# Altium schematic sheet Thermometers.SchDoc: AMC FMC Carrier v4
size A4; CompanyName: WUT; Organization: WUT ISE; Address1: Warsaw University of Technology; Address2: Nowowiejska 15/19 00-665 Warsaw; Address3: t.przywozki@gmail.com; Revision: 1; SheetNumber: 19; SheetTotal: 29; Project: AMC FMC Carrier v4.0.2; ModifiedBy: F. Świtakowski; CreateDate: XX/XX/XXXX; CheckedDate: -; Title2: Thermometers; DivGrp: ISE; Designer: T. Przywozki; ModifiedDate: -; ProjectName: ADC/DAC MEZZANINE
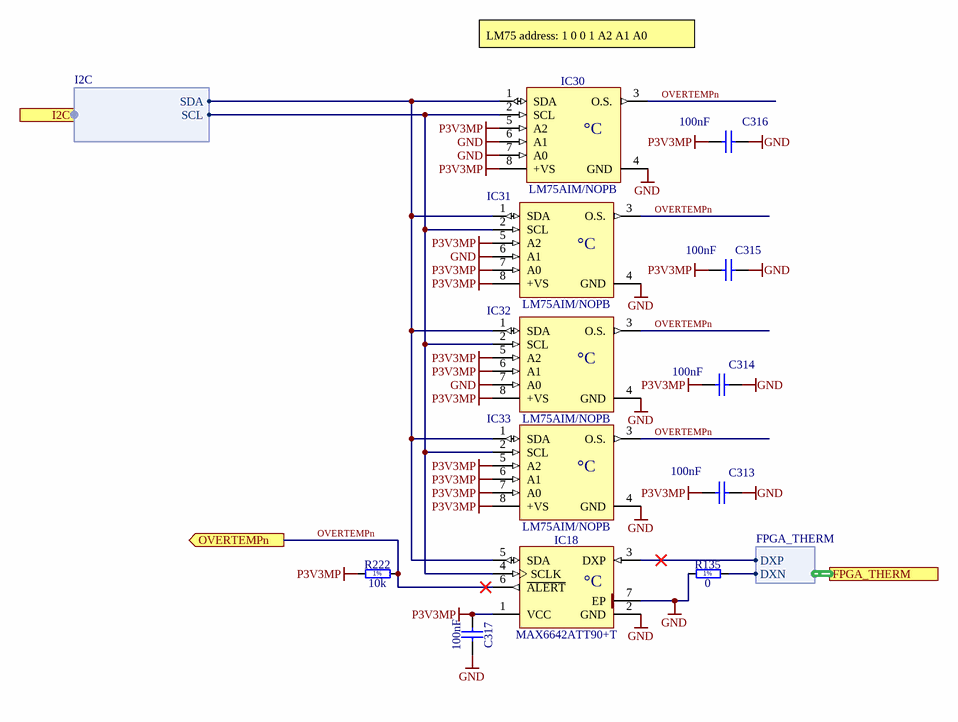
[diagram p0: Thermometers.SchDoc]

## Parts
C313  100nF  [CAPC0603X33N]
C314  100nF  [CAPC0603X33N]
C315  100nF  [CAPC0603X33N]
C316  100nF  [CAPC0603X33N]
C317  100nF  [CAPC0603X33N]
IC18  MAX6642ATT90+T  [SON95P300X300X80-7N-R160X240]
IC30  LM75AIM/NOPB  [SOIC127P600X175-8N]
IC31  LM75AIM/NOPB  [SOIC127P600X175-8N]
IC32  LM75AIM/NOPB  [SOIC127P600X175-8N]
IC33  LM75AIM/NOPB  [SOIC127P600X175-8N]
R135  0  [RESC1005X40N]
R222  10k  [RESC1005X40N]

## Ports
FPGA_THERM (harness FPGA_THERM), I2C (harness I2C), OVERTEMPn (out)

## Harnesses
FPGA_THERM: DXN, DXP
I2C: SCL, SDA

## Nets
GND: C313.2 C314.2 C315.2 C316.2 C317.2 IC18.2(GND) IC18.7(EP) IC30.4(GND) IC30.6(A1) IC30.7(A0) IC31.4(GND) IC31.6(A1) IC32.4(GND) IC32.7(A0) IC33.4(GND) R135.2
P3V3MP: C313.1 C314.1 C315.1 C316.1 C317.1 IC18.1(VCC) IC30.5(A2) IC30.8(+VS) IC31.5(A2) IC31.7(A0) IC31.8(+VS) IC32.5(A2) IC32.6(A1) IC32.8(+VS) IC33.5(A2) IC33.6(A1) IC33.7(A0) IC33.8(+VS) R222.1
OVERTEMPn: IC18.6(~{ALERT}) IC30.3(O.S.) IC31.3(O.S.) IC32.3(O.S.) IC33.3(O.S.) R222.2 ; port OVERTEMPn
NetIC18_3: IC18.3(DXP) ; port FPGA_THERM.DXP
NetIC18_4: IC18.4(SCLK) IC30.2(SCL) IC31.2(SCL) IC32.2(SCL) IC33.2(SCL) ; port I2C.SCL
NetIC18_5: IC18.5(SDA) IC30.1(SDA) IC31.1(SDA) IC32.1(SDA) IC33.1(SDA) ; port I2C.SDA
NetR135_1: R135.1 ; port FPGA_THERM.DXN

## Notes on the sheet
- LM75 address: 1 0 0 1 A2 A1 A0
- Project/Equipment
- Document
- Designer
- Drawn by
- Check.by
- Copyright CNPEM 2013, WUT ISE 2020
  This documentation describes Open Hardware and is licensed under CERN OHL v.1.1. You may redistribute and modify this documentaction under the terms of the CERN OHL v1.1.
  (http://ohwr.org/CERNOHL). This documentation is dristributed WITHOUT ANY EXPRESS OR IMPLIED WARRANTY, INCLUDING OF MERCHANTABLITY, SATISFACTORY QUALITY AND FITNESS FOR A PARTICULAR PURPOSE. Please see the CERN OHL v.1.1 for applicable conditions
- File
- Last Mod.
- Print Date
- Sheet
- Size
- A4
- of
- Rev
- Contact:
- (in symbol LM75AIM/NOPB) °C
- (in symbol MAX6642ATT90+T) °C
- (in symbol R0402_0R_JUMPER) 1%
- (in symbol R0402_10K_1%_0.0625W_100PPM) 1%

## Library data of the parts
C313-C317 = CC0201_100NF_6.3V_10%_X5R: Non-polarised capacitor; Part Description: SMD Multilayer Chip Ceramic Capacitor; Manufacturer: GENERIC; Manufacturer1 Part Number: 02016D104KAT2A; Voltage: 6.3V; TC: X5R; Tolerance: ±10%; Table: Capacitors SMD; Part Number: CC0201_100NF_6.3V_10%_X5R; Component Kind: Standard; Component Type: Standard; Pin Count: 2; Value: 100nF; Status: Not Recommended; Manufacturer Part Number: CC0201_100NF_6.3V_10%_X5R; Case: 0201; Mounted: Yes; Socket: No; SMD: Yes; Manufacturer1 Example: AVX; Manufacturer1 ComponentHeight: 0.33mm; HelpURL: \\cern.ch\dfs\Applications\Altium\Datasheets\CC0201_X5R_AVX.pdf; Author: CERN DEM JLC; CreateDate: 2007-12-03; LatestRevisionDate: 2007-12-03
IC18 = MAX6642ATT90+T: ±1°C, SMBus-Compatible Remote/Local Temperature Sensor with Overtemperature Alarm; Part Description: 0°C to +125°C, ±1°C, SMBus-Compatible Remote/Local Temperature Sensor with Overtemperature Alarm (Address 1001 000); Manufacturer: MAXIM; PressFit: No; Bonding: No; Part Number: MAX6642ATT90+T; Component Kind: Standard; Component Type: Standard; Device: MAX6642ATT90+T; PackageDescription: SON, 0.95mm Pitch; 6 Pin, 3.00mm W X 3mm L X 0.80mm H body (w/Thermal Tab 1.6mm x 2.4mm); Manufacturer Part Number: MAX6642ATT90+T; Pin Count: 7; Case: SON6; Mounted: Yes; Socket: No; SMD: Yes; Sense: No; ComponentHeight: 0.8mm; HelpURL: \\cern.ch\dfs\Applications\Altium\Datasheets\MAX6642ATT90+T.pdf; Author: CERN DEM JLC; CreateDate: 26.11.2013; LatestRevisionDate: 26.11.2013
IC30-IC33 = LM75AIM/NOPB: Digital Temperature Sensor and Thermal Watchdog with Two-Wire Interface; Part Description: -25° to +100°C ±2°C Digital Temperature Sensor and Thermal Watchdog with Two-Wire Interface; Manufacturer: TEXAS INSTRUMENTS; PressFit: No; Bonding: No; Part Number: LM75AIM/NOPB; Component Kind: Standard; Component Type: Standard; Device: LM75AIM/NOPB; PackageDescription: SOIC 8, Pitch 1.27mm - Body 4x5mm, IPC Medium Density; Manufacturer Part Number: LM75AIM/NOPB; Pin Count: 8; Case: SOIC8; Mounted: Yes; Socket: No; SMD: Yes; Sense: No; ComponentHeight: 1.75mm; HelpURL: \\cern.ch\dfs\Applications\Altium\Datasheets\LM75AIM-NOPB.pdf; Author: CERN DEM JLC; CreateDate: 15.10.2012; LatestRevisionDate: 15.10.2012
R135 = R0402_0R_JUMPER: Resistor - 1%; Part Description: 1A (0.05R Max DC Resistance) Zero Ohm Jumper; Manufacturer: GENERIC; Manufacturer1 Part Number: 232270591001L; Table: Resistors SMD; Part Number: R0402_0R_JUMPER; Component Kind: Standard; Component Type: Standard; Pin Count: 2; Value: 0; Status: Not recommended; Manufacturer Part Number: R0402_0R_JUMPER; Case: 0402; Mounted: Yes; Socket: No; SMD: Yes; Manufacturer1 Example: YAGEO PHYCOMP; Manufacturer1 ComponentHeight: 0.4mm; HelpURL: \\cern.ch\dfs\Applications\Altium\Datasheets\R0402_Phycomp_RC0402.pdf; Author: CERN DEM JLC; CreateDate: 2007-12-03; LatestRevisionDate: 2012-10-17
R222 = R0402_10K_1%_0.0625W_100PPM: Resistor - 1%; Part Description: General Purpose Thick Film Chip Resistor; Manufacturer: GENERIC; Manufacturer1 Part Number: 232270671003L; TC: ±100ppm/°C; Table: Resistors SMD; Part Number: R0402_10K_1%_0.0625W_100PPM; Component Kind: Standard; Component Type: Standard; Pin Count: 2; Value: 10k; Status: Not recommended; Power: 0.0625W; Tolerance: ±1%; Manufacturer Part Number: R0402_10K_1%_0.0625W_100PPM; Case: 0402; Mounted: Yes; Socket: No; SMD: Yes; Manufacturer1 Example: YAGEO PHYCOMP; Manufacturer1 ComponentHeight: 0.4mm; HelpURL: \\cern.ch\dfs\Applications\Altium\Datasheets\R0402_Phycomp_RC0402.pdf; Author: CERN DEM JLC; CreateDate: 2007-12-03; LatestRevisionDate: 2012-10-17